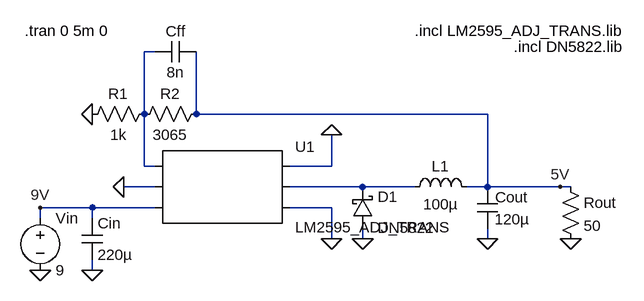
[diagram p0: schematic _LM2595_Switchmode_Regulator.asc]
_LM2595_Switchmode_Regulator.asc, the LTspice schematic file:
Version 4
SHEET 1 1824 680
WIRE -1376 -1376 -1392 -1376
WIRE -1392 -1280 -1392 -1376
WIRE -1312 -1280 -1312 -1376
WIRE -864 -1280 -1312 -1280
WIRE -1392 -1200 -1392 -1280
WIRE -1376 -1200 -1392 -1200
WIRE -1104 -1200 -1104 -1248
WIRE -1104 -1200 -1168 -1200
WIRE -1376 -1168 -1424 -1168
WIRE -1056 -1168 -1168 -1168
WIRE -976 -1168 -1056 -1168
WIRE -864 -1168 -864 -1280
WIRE -864 -1168 -896 -1168
WIRE -752 -1168 -864 -1168
WIRE -736 -1168 -752 -1168
WIRE -1472 -1136 -1552 -1136
WIRE -1376 -1136 -1472 -1136
WIRE -1104 -1136 -1168 -1136
WIRE -1552 -1120 -1552 -1136
WIRE -1472 -1120 -1472 -1136
WIRE -1104 -1088 -1104 -1136
WIRE -1056 -1088 -1056 -1104
WIRE -864 -1088 -864 -1104
WIRE -1472 -1040 -1472 -1056
FLAG -1104 -1088 0
FLAG -1056 -1088 0
FLAG -864 -1088 0
FLAG -1472 -1040 0
FLAG -1424 -1168 0
FLAG -736 -1088 0
FLAG -1552 -1040 0
FLAG -1472 -1280 0
FLAG -1104 -1248 0
FLAG -1552 -1136 9V
FLAG -752 -1168 5V
SYMBOL ind -992 -1152 R270
WINDOW 0 32 56 VTop 2
WINDOW 3 5 56 VBottom 2
SYMATTR InstName L1
SYMATTR Value 100µ
SYMBOL cap -880 -1168 R0
WINDOW 0 28 16 Left 2
WINDOW 3 27 50 Left 2
SYMATTR InstName Cout
SYMATTR Value 120µ
SYMBOL cap -1488 -1120 R0
SYMATTR InstName Cin
SYMATTR Value 220µ
SYMBOL res -752 -1184 R0
SYMATTR InstName Rout
SYMATTR Value 50
SYMBOL voltage -1552 -1136 R0
WINDOW 123 0 0 Left 0
WINDOW 39 0 0 Left 0
SYMATTR InstName Vin
SYMATTR Value 9
SYMBOL schottky -1072 -1104 M180
WINDOW 0 39 49 Left 2
WINDOW 3 39 1 Left 2
SYMATTR InstName D1
SYMATTR Value DN5822
SYMBOL res -1376 -1296 R90
WINDOW 0 0 56 VBottom 2
WINDOW 3 32 56 VTop 2
SYMATTR InstName R1
SYMATTR Value 1k
SYMBOL res -1296 -1296 R90
WINDOW 0 0 56 VBottom 2
WINDOW 3 32 56 VTop 2
SYMATTR InstName R2
SYMATTR Value 3065
SYMBOL cap -1312 -1392 R90
WINDOW 0 0 32 VBottom 2
WINDOW 3 32 32 VTop 2
SYMATTR InstName Cff
SYMATTR Value 8n
SYMBOL AutoGenerated\\LM2595_ADJ_TRANS -1280 -1168 R0
SYMATTR InstName U1
TEXT -976 -1408 Left 2 !.incl LM2595_ADJ_TRANS.lib
TEXT -824 -1384 Left 2 !.incl DN5822.lib
TEXT -1576 -1408 Left 2 !.tran 0 5m 0

The netlist it stands for:
* _LM2595_Switchmode_Regulator.asc
L1 N002 5V 100µ
Cout 5V 0 120µ
Cin 9V 0 220µ
Rout 5V 0 50
Vin 9V 0 9
D1 0 N002 DN5822
R1 N001 0 1k
R2 5V N001 3065
Cff 5V N001 8n
* U1: LM2595_ADJ_TRANS (symbol AutoGenerated\LM2595_ADJ_TRANS not available, pins judged from their places): pin1=N001 pin2=0 pin3=9V pin4=0 pin5=N002 pin6=0
.model D D
.lib standard.dio
.incl LM2595_ADJ_TRANS.lib
.incl DN5822.lib
.tran 0 5m 0
.backanno
.end